# Altium schematic sheet sensor de tension.SchDoc
size A3; PageSetup: Record=PageOptions|CenterHorizontal=True|CenterVertical=True|PrintScale=0.70|XCorrection=1.00|YCorrection=1.00|PrintKind=1|BorderSize=5000000|LeftOffset=0|BottomOffset=0|Orientation=2|PaperLength=1000|PaperWidth=1000|Scale=100|PaperSource=7|PrintQuality=-4|MediaType=1|DitherType=10|PaperKind=A4|PrintScaleMode=0
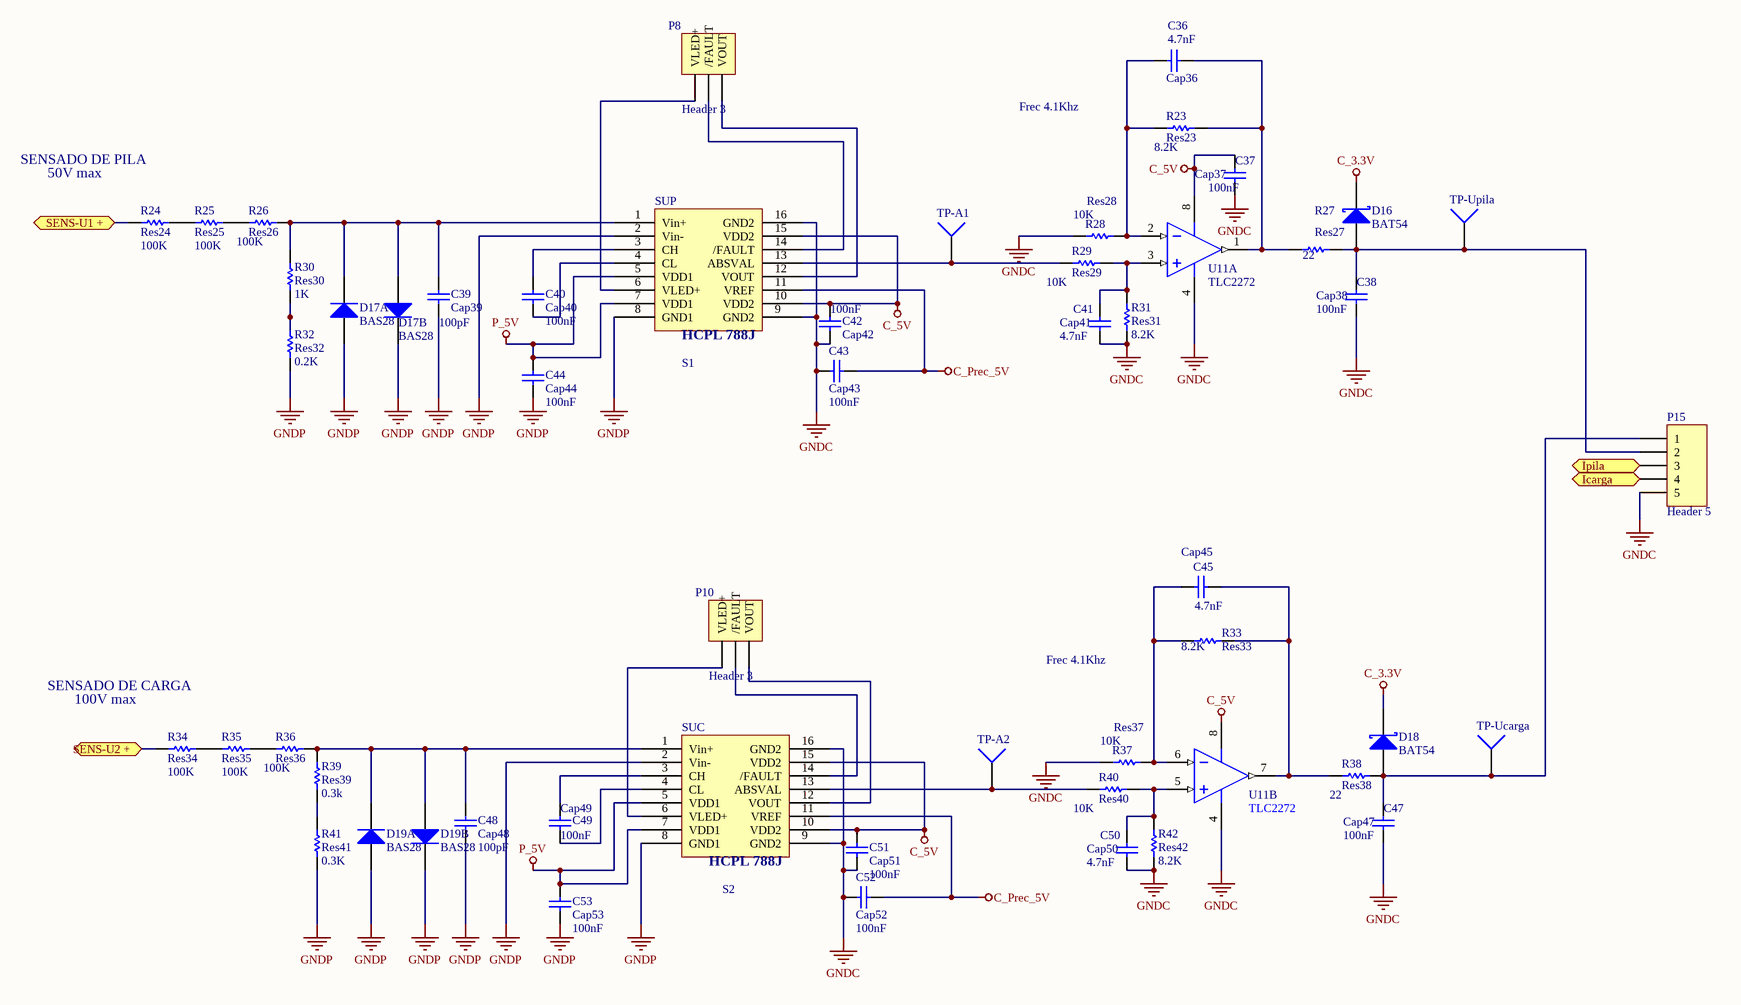
[diagram p0: sensor de tension.SchDoc]

## Parts
C36  Cap36  value 4.7nF  [RAD-0.1]
C37  Cap37  value 100nF  [8-1206]
C38  Cap38  value 100nF  [8-1206]
C39  Cap39  value 100pF  [8-1206]
C40  Cap40  value 100nF  [8-1206]
C41  Cap41  value 4.7nF  [RAD-0.1]
C42  Cap42  value 100nF  [8-1206]
C43  Cap43  value 100nF  [8-1206]
C44  Cap44  value 100nF  [8-1206]
C45  Cap45  value 4.7nF  [RAD-0.1]
C47  Cap47  value 100nF  [8-1206]
C48  Cap48  value 100pF  [8-1206]
C49  Cap49  value 100nF  [8-1206]
C50  Cap50  value 4.7nF  [RAD-0.1]
C51  Cap51  value 100nF  [8-1206]
C52  Cap52  value 100nF  [8-1206]
C53  Cap53  value 100nF  [8-1206]
D16  BAT54  [SOD123*]
D17  BAS28  [SOT-143*]  (parts A,B of 2)
D18  BAT54  [SOD123*]
D19  BAS28  [SOT-143*]  (parts A,B of 2)
P8  Header 3  [HDR1X3*]
P10  Header 3  [HDR1X3*]
P15  Header 5  [HDR1X5H*]
R23  Res23  value 8.2K  [AXIAL-0.4]
R24  Res24  value 100K  [8-1206]
R25  Res25  value 100K  [8-1206]
R26  Res26  value 100K  [8-1206]
R27  Res27  value 22  [8-1206]
R28  Res28  value 10K  [AXIAL-0.4]
R29  Res29  value 10K  [AXIAL-0.4]
R30  Res30  value 1K  [AXIAL-0.4]
R31  Res31  value 8.2K  [AXIAL-0.4]
R32  Res32  value 0.2K  [AXIAL-0.4]
R33  Res33  value 8.2K  [AXIAL-0.4]
R34  Res34  value 100K  [8-1206]
R35  Res35  value 100K  [8-1206]
R36  Res36  value 100K  [8-1206]
R37  Res37  value 10K  [AXIAL-0.4]
R38  Res38  value 22  [8-1206]
R39  Res39  value 0.3k  [AXIAL-0.4]
R40  Res40  value 10K  [AXIAL-0.4]
R41  Res41  value 0.3K  [AXIAL-0.4]
R42  Res42  value 8.2K  [AXIAL-0.4]
SUC  S2  [Sens Tension HCPL-788J]
SUP  S1  [Sens Tension HCPL-788J]
TP-A1  (no value)  [PIN1]
TP-A2  (no value)  [PIN1]
TP-Ucarga  (no value)  [PIN1]
TP-Upila  (no value)  [PIN1]
U11  TLC2272  [751-02_N]  (parts A,B of 2)

## Ports
Icarga, Ipila, SENS-U1 + (bidir), SENS-U2 + (bidir)

## Nets
C_3.3V: D16.2(K) D18.2(K)
C_5V: C37.1 C42.2 C51.2 SUC.10(VDD2) SUC.15(VDD2) SUP.10(VDD2) SUP.15(VDD2) U11.8(VDD)
C_Prec_5V: C43.2 C52.2 SUC.11(VREF) SUP.11(VREF)
GNDC: C37.2 C38.2 C41.2 C42.1 C43.1 C47.2 C50.2 C51.1 C52.1 P15.5 R28.1 R31.2 R37.1 R42.2 SUC.9(GND2) SUC.16(GND2) SUP.9(GND2) SUP.16(GND2) U11.4(GND)
GNDP: C39.2 C44.2 C48.2 C53.2 D17.2(K) D17.4(A) D19.2(K) D19.4(A) R32.2 R41.2 SUC.2(Vin-) SUC.8(GND1) SUP.2(Vin-) SUP.8(GND1)
P_5V: C44.1 C53.1 SUC.5(VDD1) SUC.7(VDD1) SUP.5(VDD1) SUP.7(VDD1)
Icarga: P15.4 ; port Icarga
Ipila: P15.3 ; port Ipila
SENS-U1 +: R24.1 ; port SENS-U1 +
SENS-U2 +: R34.1 ; port SENS-U2 +
NetC36_1: C36.1 R23.1 R28.2 U11.2(IN-)
NetC36_2: C36.2 R23.2 R27.1 U11.1(OUT)
NetC38_1: C38.1 D16.1(A) P15.2 R27.2 TP-Upila.1
NetC39_1: C39.1 D17.1(K) D17.3(A) R26.2 R30.1 SUP.1(Vin+)
NetC40_1: C40.1 SUP.3(CH)
NetC40_2: C40.2 SUP.4(CL)
NetC41_1: C41.1 R29.2 R31.1 U11.3(IN+)
NetC45_1: C45.1 R33.1 R37.2 U11.6(IN-)
NetC45_2: C45.2 R33.2 R38.1 U11.7(OUT)
NetC47_1: C47.1 D18.1(A) P15.1 R38.2 TP-Ucarga.1
NetC48_1: C48.1 D19.1(K) D19.3(A) R36.2 R39.1 SUC.1(Vin+)
NetC49_1: C49.1 SUC.3(CH)
NetC49_2: C49.2 SUC.4(CL)
NetC50_1: C50.1 R40.2 R42.1 U11.5(IN+)
NetP8_1: P8.1(VLED+) SUP.6(VLED+)
NetP8_2: P8.2(/FAULT) SUP.14(/FAULT)
NetP8_3: P8.3(VOUT) SUP.12(VOUT)
NetP10_1: P10.1(VLED+) SUC.6(VLED+)
NetP10_2: P10.2(/FAULT) SUC.14(/FAULT)
NetP10_3: P10.3(VOUT) SUC.12(VOUT)
NetR24_2: R24.2 R25.1
NetR25_2: R25.2 R26.1
NetR29_1: R29.1 SUP.13(ABSVAL) TP-A1.1
NetR30_2: R30.2 R32.1
NetR34_2: R34.2 R35.1
NetR35_2: R35.2 R36.1
NetR39_2: R39.2 R41.1
NetR40_1: R40.1 SUC.13(ABSVAL) TP-A2.1

## Notes on the sheet
- SENSADO DE PILA
- Frec 4.1Khz
- 50V max
- SENSADO DE CARGA
- 100V max
- (in symbol Component_1) HCPL 788J

## Library data of the parts
C36 C41 C45 C50 = Cap: THRU MULTICAPA 50V; Published: 8-Jun-2000; LatestRevisionDate: 17-Jul-2002; LatestRevisionNote: Re-released for DXP Platform.; PackageReference: RAD-0.3; Publisher: Altium Limited; PackageDescription: Radial Cap, Thru-Hole; 2 Leads; 0.3 in Pin Spacing
C37-C40 C42-C44 C47-C49 C51-C53 = Cap: SMD MULTICAPA 50V; Published: 8-Jun-2000; LatestRevisionDate: 17-Jul-2002; LatestRevisionNote: Re-released for DXP Platform.; PackageReference: RAD-0.3; Publisher: Altium Limited; PackageDescription: Radial Cap, Thru-Hole; 2 Leads; 0.3 in Pin Spacing
D16 D18 = BAT54: SMD; Note: Pin 2 is not connected and is not drawn; Published: 17-Sep-2003; LatestRevisionDate: 12-Dec-2006; LatestRevisionNote: IPC-7351 Footprint Added.; DatasheetVersion: 4-Mar-2002; PackageVersion: May-1999; PackageReference: SOT23; Publisher: Altium Limited; PackageDescription: 3-Pin SOT-23 Package 0.95 mm Pitch, 2.3 mm Lead Span; ComponentLink1Description: Manufacturer Link; ComponentLink1URL: http://www.semiconductors.philips.com/; ComponentLink2Description: Datasheet; ComponentLink2URL: http://www.semiconductors.philips.com/acrobat/datasheets/BAT54_SERIES_4.pdf
D17 = BAS28: SMD; Published: 17-Sep-2003; LatestRevisionDate: 12-Dec-2006; LatestRevisionNote: IPC-7351 Footprint Added.; DatasheetVersion: 10-Sep-1996; PackageVersion: Sep-1996; PackageReference: SOT143; Publisher: Altium Limited; PackageDescription: 4-Pin SOT-143 Package 1.9 mm Pitch, 2.3 mm Lead Span; Code_IPC: SOT143; ComponentLink1Description: Manufacturer Link; ComponentLink1URL: http://www.semiconductors.philips.com/; ComponentLink2Description: Datasheet; ComponentLink2URL: http://www.semiconductors.philips.com/acrobat/datasheets/BAS28_2.pdf
D19 = BAS28: High-speed Switching, Double Diode SMD; Published: 17-Sep-2003; LatestRevisionDate: 12-Dec-2006; LatestRevisionNote: IPC-7351 Footprint Added.; DatasheetVersion: 10-Sep-1996; PackageVersion: Sep-1996; PackageReference: SOT143; Publisher: Altium Limited; PackageDescription: 4-Pin SOT-143 Package 1.9 mm Pitch, 2.3 mm Lead Span; Code_IPC: SOT143; ComponentLink1Description: Manufacturer Link; ComponentLink1URL: http://www.semiconductors.philips.com/; ComponentLink2Description: Datasheet; ComponentLink2URL: http://www.semiconductors.philips.com/acrobat/datasheets/BAS28_2.pdf
P8 P10 = Header 3: Header, 3-Pin; LatestRevisionDate: 17-Jul-2002; LatestRevisionNote: Re-released for DXP Platform.; Publisher: Altium Limited
P15 = Header 5: Header, 5-Pin; LatestRevisionDate: 17-Jul-2002; LatestRevisionNote: Re-released for DXP Platform.; Publisher: Altium Limited
R23 R28-R33 R37 R39-R42 = Res1: Resistor; Published: 8-Jun-2000; LatestRevisionDate: 17-Jul-2002; LatestRevisionNote: Re-released for DXP Platform.; PackageReference: AXIAL-0.3; Publisher: Altium Limited; PackageDescription: Axial Device, Thru-Hole; 2 Leads; 0.3 in Pin Spacing
R24-R27 R34-R36 R38 = Res1: SMD 1206; Published: 8-Jun-2000; LatestRevisionDate: 17-Jul-2002; LatestRevisionNote: Re-released for DXP Platform.; PackageReference: AXIAL-0.3; Publisher: Altium Limited; PackageDescription: Axial Device, Thru-Hole; 2 Leads; 0.3 in Pin Spacing
SUC SUP = Component_1
TP-A1 TP-A2 TP-Ucarga TP-Upila = Socket: LatestRevisionDate: 17-Jul-2002; LatestRevisionNote: Re-released for DXP Platform.; Publisher: Altium Limited
U11 = TLC27L2ACDR: LinCMOS Precision Dual Operational Amplifier; Published: 15-Apr-2002; LatestRevisionDate: 13-Apr-2006; LatestRevisionNote: IPC-7351 Footprint Added.; DatasheetVersion: Aug-1988; PackageVersion: Jan-1998; PackageReference: D008; Publisher: Altium Limited; PackageDescription: 8-Pin Small Outline Integrated Circuit 1.27 mm Pitch; Code_IPC: SOIC127P600-8; ComponentLink1Description: Manufacturer Link; ComponentLink1URL: http://www.ti.com/; ComponentLink2Description: Datasheet; ComponentLink2URL: http://www-s.ti.com/sc/ds/tlc27l2a.pdf